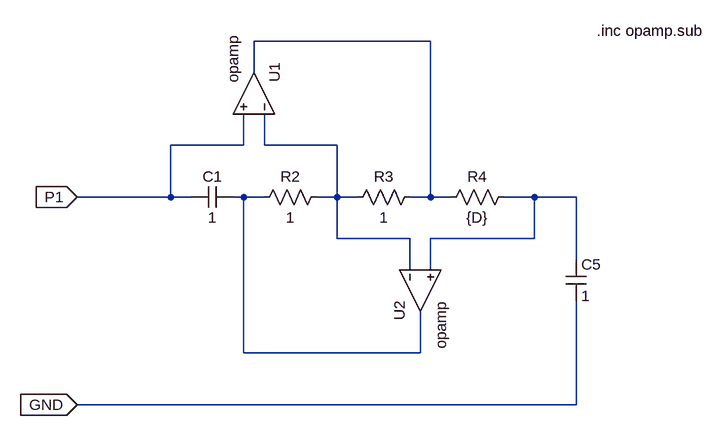
[diagram p0: schematic FDNR.asc]
FDNR.asc, the LTspice schematic file:
Version 4
SHEET 1 880 680
WIRE 336 -48 64 -48
WIRE 64 0 64 -48
WIRE 48 112 48 64
WIRE 48 112 -64 112
WIRE 80 112 80 64
WIRE 192 112 80 112
WIRE -64 192 -64 112
WIRE -64 192 -208 192
WIRE -32 192 -64 192
WIRE 48 192 32 192
WIRE 80 192 48 192
WIRE 192 192 192 112
WIRE 192 192 160 192
WIRE 224 192 192 192
WIRE 336 192 336 -48
WIRE 336 192 304 192
WIRE 368 192 336 192
WIRE 496 192 448 192
WIRE 560 192 496 192
WIRE 192 256 192 192
WIRE 304 256 192 256
WIRE 496 256 496 192
WIRE 496 256 336 256
WIRE 560 288 560 192
WIRE 304 304 304 256
WIRE 336 304 336 256
WIRE 48 432 48 192
WIRE 320 432 320 368
WIRE 320 432 48 432
WIRE 560 512 560 352
WIRE 560 512 -208 512
FLAG -208 192 P1
IOPIN -208 192 In
FLAG -208 512 GND
IOPIN -208 512 In
SYMBOL Opamps\\opamp 128 32 M270
SYMATTR InstName U1
SYMBOL Opamps\\opamp 256 336 M90
SYMATTR InstName U2
SYMBOL cap 32 176 R90
WINDOW 0 0 32 VBottom 2
WINDOW 3 32 32 VTop 2
SYMATTR InstName C1
SYMATTR Value 1
SYMBOL cap 544 288 R0
SYMATTR InstName C5
SYMATTR Value 1
SYMBOL res 176 176 R90
WINDOW 0 0 56 VBottom 2
WINDOW 3 32 56 VTop 2
SYMATTR InstName R2
SYMATTR Value 1
SYMBOL res 320 176 R90
WINDOW 0 0 56 VBottom 2
WINDOW 3 32 56 VTop 2
SYMATTR InstName R3
SYMATTR Value 1
SYMBOL res 464 176 R90
WINDOW 0 0 56 VBottom 2
WINDOW 3 32 56 VTop 2
SYMATTR InstName R4
SYMATTR Value {D}
TEXT 592 -64 Left 2 !.inc opamp.sub

The netlist it stands for:
* FDNR.asc
XU1 N002 P1 N001 opamp Aol=100K GBW=10Meg  ; pins invin noninvin out
XU2 N002 N004 N003 opamp Aol=100K GBW=10Meg  ; pins invin noninvin out
C1 N003 P1 1
C5 N004 GND 1
R2 N002 N003 1
R3 N001 N002 1
R4 N004 N001 {D}
.inc opamp.sub
.backanno
.end